# Altium project dcdc_30A.PrjPcb
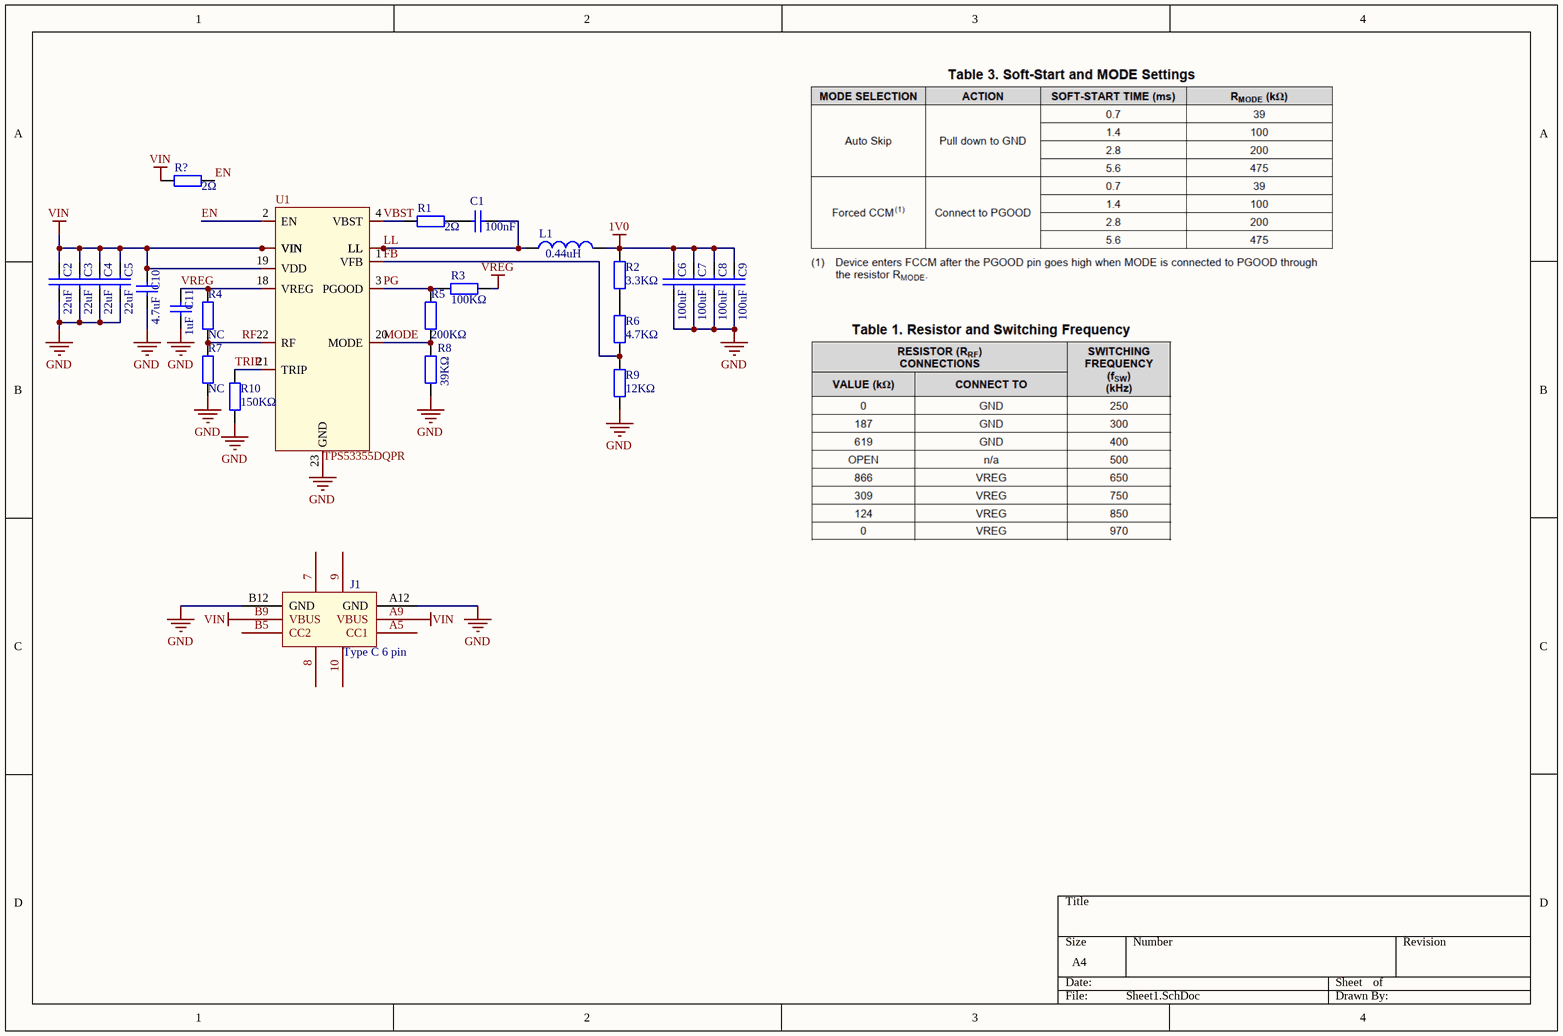
[diagram p0: Sheet1.SchDoc]
1 sheet, 25 parts. Net scope: global (net labels, ports and power ports of the same name join across sheets).
Board file: PCB1.PcbDoc

## Sheet Sheet1.SchDoc
size A4; SheetNumber: 1; SheetTotal: 1

### Parts
C1  100nF  [0805_C]
C2  22uF  [0805_C]
C3  22uF  [0805_C]
C4  22uF  [0805_C]
C5  22uF  [0805_C]
C6  100uF  [1206_C]
C7  100uF  [1206_C]
C8  100uF  [1206_C]
C9  100uF  [1206_C]
C10  4.7uF  [0805_C]
C11  1uF  [0805_C]
J1  Type C 6 pin  [USB type C 6pin]
L1  value 0.44uH  [PCBComponent_1 - duplicate2]  (hidden comment: Inductor)
R1  2Ω  [0805_R]
R2  3.3KΩ  [0805_R]
R3  100KΩ  [0805_R]
R4  NC  [0805_R]
R5  200KΩ  [0805_R]
R6  4.7KΩ  [0805_R]
R7  NC  [0805_R]
R8  39KΩ  [0805_R]
R9  12KΩ  [0805_R]
R10  150KΩ  [0805_R]
R?  2Ω  [0805_R]
U1  TPS53355DQPR  [LSON-22_L6.0-W5.0-P0.50-BL-EP]

### Nets
1V0: C6.2 C7.2 C8.2 C9.2 L1.2 R2.1
GND: C2.1 C3.1 C4.1 C5.1 C6.1 C7.1 C8.1 C9.1 C10.1 C11.1 J1.A12(GND) J1.B12(GND) R7.1 R8.1 R9.1 R10.1 U1.23(GND)
VIN: C2.2 C3.2 C4.2 C5.2 C10.2 J1.A9(VBUS) J1.B9(VBUS) R?.1 U1.12(VIN) U1.13(VIN) U1.14(VIN) U1.15(VIN) U1.16(VIN) U1.17(VIN) U1.19(VDD)
VREG: C11.2 R3.1 R4.2 U1.18(VREG)
EN: R?.2 U1.2(EN)
FB: R6.2 R9.2 U1.1(VFB)
LL: C1.2 L1.1 U1.6(LL) U1.7(LL) U1.8(LL) U1.9(LL) U1.10(LL) U1.11(LL)
MODE: R5.1 R8.2 U1.20(MODE)
PG: R3.2 R5.2 U1.3(PGOOD)
RF: R4.1 R7.2 U1.22(RF)
TRIP: R10.2 U1.21(TRIP)
VBST: R1.1 U1.4(VBST)
NetC1_1: C1.1 R1.2
NetR2_2: R2.2 R6.1

Not connected (* = marked no-connect by the designer): J1 7 8 9 10 A5(CC1) B5(CC2)

### Library data of the parts
C1 = 0805 100nF(104) 10% 50V: 贴片电容; ComponentLink1Description: 供应商链接; ComponentLink1URL: http://www.szlcsc.com/product/details_50686.html; Package: 0805; Supplier: LC; SuppliersPartNumber: C49678
C2-C5 = 0805 22uF (226) 20% 25V: 贴片电容; ComponentLink1Description: 供应商链接; ComponentLink1URL: http://www.szlcsc.com/product/details_46786.html; Package: 0805; Supplier: LC; SuppliersPartNumber: C45783
C6-C9 = 1206 100nF (104) 10% 50V: 贴片电容; ComponentLink1Description: 供应商链接; ComponentLink1URL: http://www.szlcsc.com/product/details_25237.html; Package: 1206; Supplier: LC; SuppliersPartNumber: C24497
C10 = 0805 4.7uF (475) 10% 25V: 贴片电容; ComponentLink1Description: 供应商链接; ComponentLink1URL: http://www.szlcsc.com/product/details_2131.html; Package: 0805; Supplier: LC; SuppliersPartNumber: C1779
C11 = 0805 1uF (105) 10% 50V: 贴片电容; ComponentLink1Description: 供应商链接; ComponentLink1URL: http://www.szlcsc.com/product/details_29074.html; Package: 0805; Supplier: LC; SuppliersPartNumber: C28323
L1 = Inductor: Code_IEC: 1005; Published: 8-Jun-2000; LatestRevisionDate: 29-May-2009; LatestRevisionNote: IPC-7351 Footprint Added.; PackageReference: 0402-A; Publisher: Altium Limited; PackageDescription: Chip Inductor; Code_JEITA: 0402
R1 R? = 0805 2.2Ω (2R20) 1%: 贴片电阻; ComponentLink1Description: 供应商链接; ComponentLink1URL: http://www.szlcsc.com/product/details_18209.html; Package: 0805; Supplier: LC; SuppliersPartNumber: C17521
R2 = 0805 3.3KΩ (3301) 1%: 贴片电阻; ComponentLink1Description: 供应商链接; ComponentLink1URL: http://www.szlcsc.com/product/details_26753.html; Package: 0805; Supplier: LC; SuppliersPartNumber: C26010
R3 = 0805 100KΩ (1003) 1%: 贴片电阻; ComponentLink1Description: 供应商链接; ComponentLink1URL: http://www.szlcsc.com/product/details_18095.html; Package: 0805; Supplier: LC; SuppliersPartNumber: C17407
R4 R7 R8 = 0805 39KΩ (3902) 1%: 贴片电阻; ComponentLink1Description: 供应商链接; ComponentLink1URL: http://www.szlcsc.com/product/details_26569.html; Package: 0805; Supplier: LC; SuppliersPartNumber: C25826
R5 = 0805 200KΩ (2003) 1%: 贴片电阻; ComponentLink1Description: 供应商链接; ComponentLink1URL: http://www.szlcsc.com/product/details_18227.html; Package: 0805; Supplier: LC; SuppliersPartNumber: C17539
R6 = 0805 4.7KΩ (4701) 1%: 贴片电阻; ComponentLink1Description: 供应商链接; ComponentLink1URL: http://www.szlcsc.com/product/details_18361.html; Package: 0805; Supplier: LC; SuppliersPartNumber: C17673
R9 = 0805 12KΩ (1202) 1%: 贴片电阻; ComponentLink1Description: 供应商链接; ComponentLink1URL: http://www.szlcsc.com/product/details_18132.html; Package: 0805; Supplier: LC; SuppliersPartNumber: C17444
R10 = 0805 150KΩ (1503) 1%: 贴片电阻; ComponentLink1Description: 供应商链接; ComponentLink1URL: http://www.szlcsc.com/product/details_18158.html; Package: 0805; Supplier: LC; SuppliersPartNumber: C17470
U1 = TPS53355DQPR: 具有 Eco-mode 的 TPS53355 1.5V 至 15V 输入（4.5V 至 25V 偏置）、 / 30A 同步降压 SWIFT™ / 转换器™; Manufacturer: TI(德州仪器); Add into BOM: yes; Function: 降压型; Output Type: 可调; Voltage - Supply: 1.5V~15V; Output Voltage: 600mV~5.5V; Frequency - Switching: 1MHz; Synchronous Rectifier: 是; Number of Outputs: 1; Topology: 降压式; Switch tube (built-in/external): 内置; Symbol: TPS53355DQPR; Device: TPS53355DQPR; LCSC Part Name: 30A同步降压转换器; Supplier Part: C148172; Manufacturer Part: TPS53355DQPR; Supplier Footprint: LSON-22-EP(5x6); JLCPCB Part Class: Extended Part; Datasheet: https://item.szlcsc.com/datasheet/TPS53355DQPR/159505.html; Supplier: LCSC; Convert to PCB: yes; Output Current: 30A; Operating Temperature: -40℃~+125℃; Quiescent Current: -